# Altium project CPU_PCB.PrjPCB
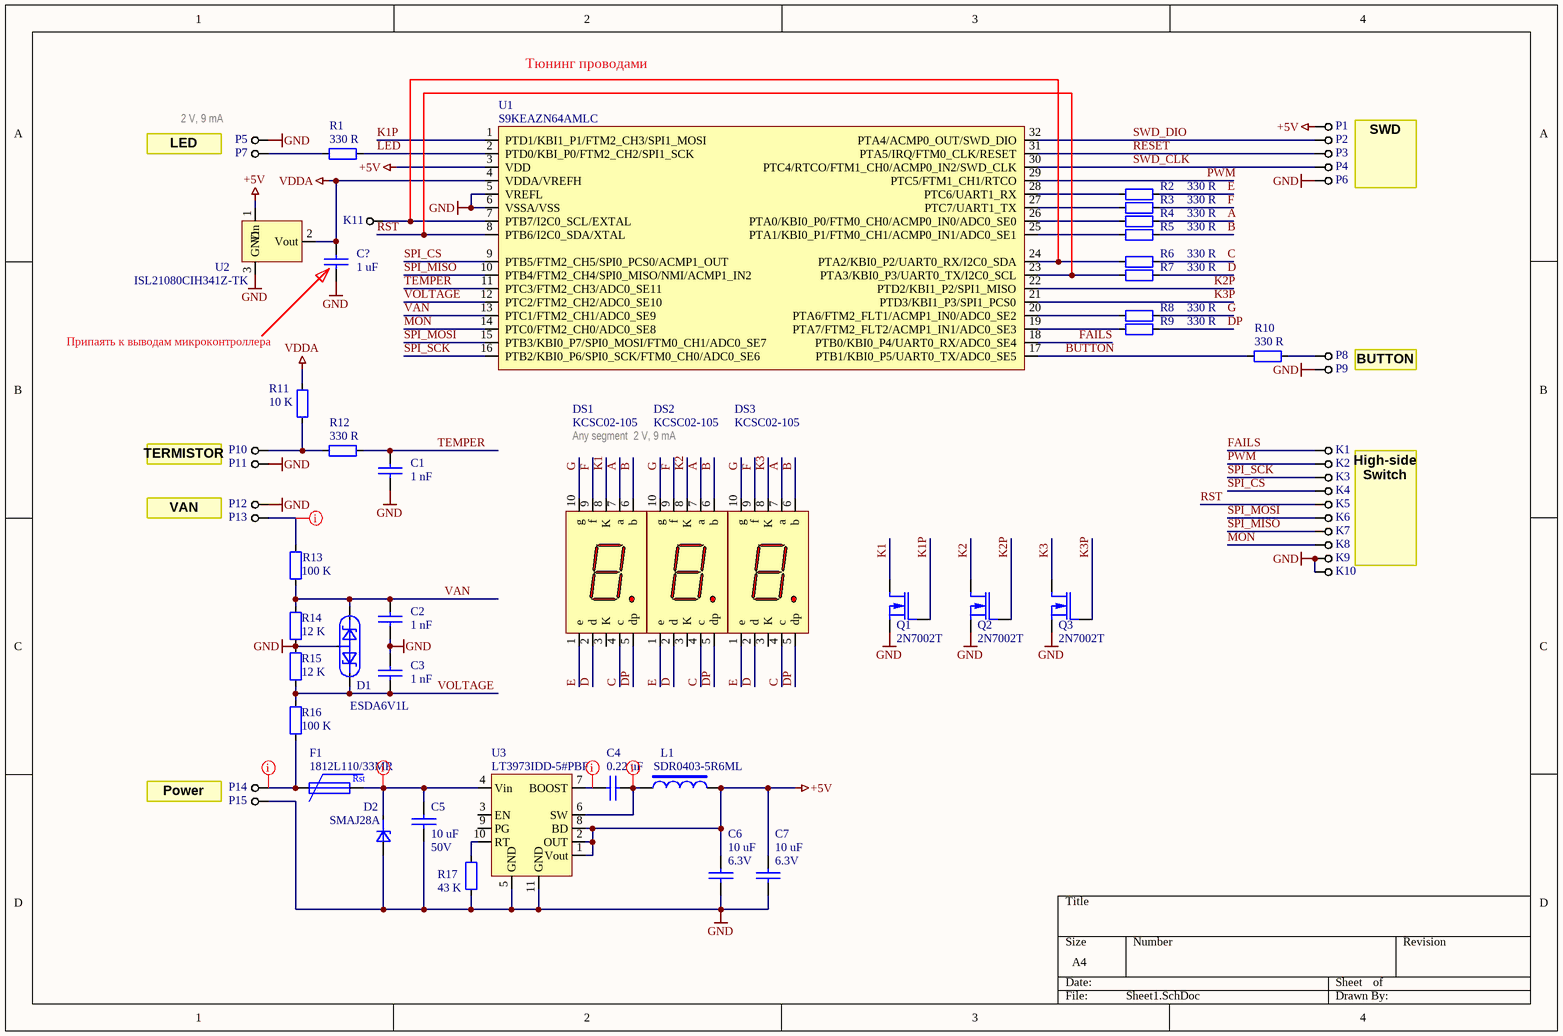
[diagram p0: Sheet1.SchDoc]
1 sheet, 64 parts. Net scope: global (net labels, ports and power ports of the same name join across sheets).
Board file: CPU_PCB.PcbDoc

## Sheet Sheet1.SchDoc
size A4

### Parts
C1  value 1 nF  [1608[0603]]  (hidden comment: CL10B102KB8NNNC)
C2  value 1 nF  [1608[0603]]  (hidden comment: CL10B102KB8NNNC)
C3  value 1 nF  [1608[0603]]  (hidden comment: CL10B102KB8NNNC)
C4  value 0.22 uF  [2012[0805]]  (hidden comment: C0805C224K5RACTU)
C5  value 10 uF  Voltage: 50V  [3225[1210]]  (hidden comment: GRM32DF51H106ZA01L)
C6  value 10 uF  Voltage: 6.3V  [0805-1206]  (hidden comment: GRM21BR60J106KE19L)
C7  value 10 uF  Voltage: 6.3V  [0805-1206]  (hidden comment: GRM21BR60J106KE19L)
C?  value 1 uF  [1608[0603]]  (hidden comment: CL10B102KB8NNNC)
D1  ESDA6V1L  [SOT23]
D2  SMAJ28A  [SMA]
DS1  KCSC02-105  [KCSC02-105]
DS2  KCSC02-105  [KCSC02-105]
DS3  KCSC02-105  [KCSC02-105]
F1  1812L110/33MR  [CR4532-1812/Y1.6]
K1  Pin 0.7 mm  [Mount hole 0.7 mm]  (value not drawn)  (net tie, no BOM)
K2  Pin 0.7 mm  [Mount hole 0.7 mm]  (value not drawn)  (net tie, no BOM)
K3  Pin 0.7 mm  [Mount hole 0.7 mm]  (value not drawn)  (net tie, no BOM)
K4  Pin 0.7 mm  [Mount hole 0.7 mm]  (value not drawn)  (net tie, no BOM)
K5  Pin 0.7 mm  [Mount hole 0.7 mm]  (value not drawn)  (net tie, no BOM)
K6  Pin 0.7 mm  [Mount hole 0.7 mm]  (value not drawn)  (net tie, no BOM)
K7  Pin 0.7 mm  [Mount hole 0.7 mm]  (value not drawn)  (net tie, no BOM)
K8  Pin 0.7 mm  [Mount hole 0.7 mm]  (value not drawn)  (net tie, no BOM)
K9  Pin 0.7 mm  [Mount hole 0.7 mm]  (value not drawn)  (net tie, no BOM)
K10  Pin 0.7 mm  [Mount hole 0.7 mm]  (value not drawn)  (net tie, no BOM)
K11  Pin 0.7 mm  [Mount hole 0.7 mm]  (value not drawn)  (net tie, no BOM)
L1  SDR0403-5R6ML  [SDR0403]
P1  Pin 0.7 mm  [Mount hole 0.7 mm]  (value not drawn)  (net tie, no BOM)
P2  Pin 0.7 mm  [Mount hole 0.7 mm]  (value not drawn)  (net tie, no BOM)
P3  Pin 0.7 mm  [Mount hole 0.7 mm]  (value not drawn)  (net tie, no BOM)
P4  Pin 0.7 mm  [Mount hole 0.7 mm]  (value not drawn)  (net tie, no BOM)
P5  Pin 0.7 mm  [Mount hole 0.7 mm]  (value not drawn)  (net tie, no BOM)
P6  Pin 0.7 mm  [Mount hole 0.7 mm]  (value not drawn)  (net tie, no BOM)
P7  Pin 0.7 mm  [Mount hole 0.7 mm]  (value not drawn)  (net tie, no BOM)
P8  Pin 0.7 mm  [Mount hole 0.7 mm]  (value not drawn)  (net tie, no BOM)
P9  Pin 0.7 mm  [Mount hole 0.7 mm]  (value not drawn)  (net tie, no BOM)
P10  Pin 0.7 mm  [Mount hole 0.7 mm]  (value not drawn)  (net tie, no BOM)
P11  Pin 0.7 mm  [Mount hole 0.7 mm]  (value not drawn)  (net tie, no BOM)
P12  Pin 0.7 mm  [Mount hole 0.7 mm]  (value not drawn)  (net tie, no BOM)
P13  Pin 0.7 mm  [Mount hole 0.7 mm]  (value not drawn)  (net tie, no BOM)
P14  Pin 0.7 mm  [Mount hole 0.7 mm]  (value not drawn)  (net tie, no BOM)
P15  Pin 0.7 mm  [Mount hole 0.7 mm]  (value not drawn)  (net tie, no BOM)
Q1  2N7002T  [SOT-523F]
Q2  2N7002T  [SOT-523F]
Q3  2N7002T  [SOT-523F]
R1  value 330 R  [0603]  (hidden comment: RC0603FR-07330RL)
R2  value 330 R  [0603]  (hidden comment: RC0603FR-07330RL)
R3  value 330 R  [0603]  (hidden comment: RC0603FR-07330RL)
R4  value 330 R  [0603]  (hidden comment: RC0603FR-07330RL)
R5  value 330 R  [0603]  (hidden comment: RC0603FR-07330RL)
R6  value 330 R  [0603]  (hidden comment: RC0603FR-07330RL)
R7  value 330 R  [0603]  (hidden comment: RC0603FR-07330RL)
R8  value 330 R  [0603]  (hidden comment: RC0603FR-07330RL)
R9  value 330 R  [0603]  (hidden comment: RC0603FR-07330RL)
R10  value 330 R  [0603]  (hidden comment: RC0603FR-07330RL)
R11  value 10 K  [0603]  (hidden comment: ERJ-3EKF1002V)
R12  value 330 R  [0603]  (hidden comment: RC0603FR-07330RL)
R13  value 100 K  [0603]  (hidden comment: RC0603FR-10100KL)
R14  value 12 K  [0603]  (hidden comment: RL0603K012-1)
R15  value 12 K  [0603]  (hidden comment: RL0603K012-1)
R16  value 100 K  [0603]  (hidden comment: RC0603FR-10100KL)
R17  value 43 K  [0603]  (hidden comment: RL0603K043-1)
U1  S9KEAZN64AMLC  [LQFP-32 Freescale]
U2  ISL21080CIH341Z-TK  [SOT23]
U3  LT3973IDD-5#PBF  [10-DFN Linear]

### Nets
+5V: C6.2 C7.2 L1.2 P1.1 U1.3(VDD) U2.1(Vin) U3.1(Vout) U3.2(OUT) U3.8(BD)
GND: C1.2 C2.2 C3.1 C5.2 C6.1 C7.1 C?.2 D1.3 D2.2(A) K9.1 K10.1 P5.1 P6.1 P9.1 P11.1 P12.1 P15.1 Q1.2(S) Q2.2(S) Q3.2(S) R14.1 R15.2 R17.1 U1.5(VREFL) U1.6(VSSA/VSS) U2.3(GND) U3.5(GND) U3.11(GND)
VDDA: C?.1 R11.2 U1.4(VDDA/VREFH) U2.2(Vout)
A: DS1.7(a) DS2.7(a) DS3.7(a) R4.2
B: DS1.6(b) DS2.6(b) DS3.6(b) R5.2
BUTTON: R10.1 U1.17(PTB1/KBI0_P5/UART0_TX/ADC0_SE5)
C: DS1.4(c) DS2.4(c) DS3.4(c) R6.2
D: DS1.2(d) DS2.2(d) DS3.2(d) R7.2
DP: DS1.5(dp) DS2.5(dp) DS3.5(dp) R9.2
E: DS1.1(e) DS2.1(e) DS3.1(e) R2.2
F: DS1.9(f) DS2.9(f) DS3.9(f) R3.2
FAILS: K1.1 U1.18(PTB0/KBI0_P4/UART0_RX/ADC0_SE4)
G: DS1.10(g) DS2.10(g) DS3.10(g) R8.2
K1: DS1.8(K) Q1.3(D)
K1P: Q1.1(G) U1.1(PTD1/KBI1_P1/FTM2_CH3/SPI1_MOSI)
K2: DS2.8(K) Q2.3(D)
K2P: Q2.1(G) U1.22(PTD2/KBI1_P2/SPI1_MISO)
K3: DS3.8(K) Q3.3(D)
K3P: Q3.1(G) U1.21(PTD3/KBI1_P3/SPI1_PCS0)
LED: R1.2 U1.2(PTD0/KBI_P0/FTM2_CH2/SPI1_SCK)
MON: K8.1 U1.14(PTC0/FTM2_CH0/ADC0_SE8)
PWM: K2.1 U1.29(PTC5/FTM1_CH1/RTCO)
RESET: P3.1 U1.31(PTA5/IRQ/FTM0_CLK/RESET)
RST: K5.1 R7.1 U1.8(PTB6/I2C0_SDA/XTAL) U1.23(PTA3/KBI0_P3/UART0_TX/I2C0_SCL)
SPI_CS: K4.1 U1.9(PTB5/FTM2_CH5/SPI0_PCS0/ACMP1_OUT)
SPI_MISO: K7.1 U1.10(PTB4/FTM2_CH4/SPI0_MISO/NMI/ACMP1_IN2)
SPI_MOSI: K6.1 U1.15(PTB3/KBI0_P7/SPI0_MOSI/FTM0_CH1/ADC0_SE7)
SPI_SCK: K3.1 U1.16(PTB2/KBI0_P6/SPI0_SCK/FTM0_CH0/ADC0_SE6)
SWD_CLK: P4.1 U1.30(PTC4/RTCO/FTM1_CH0/ACMP0_IN2/SWD_CLK)
SWD_DIO: P2.1 U1.32(PTA4/ACMP0_OUT/SWD_DIO)
TEMPER: C1.1 R12.2 U1.11(PTC3/FTM2_CH3/ADC0_SE11)
VAN: C2.1 D1.1 R13.1 R14.2 U1.13(PTC1/FTM2_CH1/ADC0_SE9)
VOLTAGE: C3.2 D1.2 R15.1 R16.2 U1.12(PTC2/FTM2_CH2/ADC0_SE10)
NetC4_1: C4.1 U3.7(BOOST)
NetC4_2: C4.2 L1.1 U3.6(SW)
NetC5_1: C5.1 D2.1(K) F1.2 U3.4(Vin)
NetF1_1: F1.1 P14.1 R16.1
NetK11_1: K11.1 R6.1 U1.7(PTB7/I2C0_SCL/EXTAL) U1.24(PTA2/KBI0_P2/UART0_RX/I2C0_SDA)
NetP7_1: P7.1 R1.1
NetP8_1: P8.1 R10.2
NetP10_1: P10.1 R11.1 R12.1
NetP13_1: P13.1 R13.2
NetR2_1: R2.1 U1.28(PTC6/UART1_RX)
NetR3_1: R3.1 U1.27(PTC7/UART1_TX)
NetR4_1: R4.1 U1.26(PTA0/KBI0_P0/FTM0_CH0/ACMP0_IN0/ADC0_SE0)
NetR5_1: R5.1 U1.25(PTA1/KBI0_P1/FTM0_CH1/ACMP0_IN1/ADC0_SE1)
NetR8_1: R8.1 U1.20(PTA6/FTM2_FLT1/ACMP1_IN0/ADC0_SE2)
NetR9_1: R9.1 U1.19(PTA7/FTM2_FLT2/ACMP1_IN1/ADC0_SE3)
NetR17_2: R17.2 U3.10(RT)

Not connected (* = marked no-connect by the designer): DS1 3(K); DS2 3(K); DS3 3(K); U3 3(EN) 9(PG)

### Layout directives
net class 24V: NetC4_1, NetC4_2, NetC5_1, NetF1_1, NetP13_1

### Notes on the sheet
- Тюнинг проводами
- LED
- 2 V, 9 mA
- SWD
- Припаять к выводам микроконтроллера
- BUTTON
- Any segment  2 V, 9 mA
- VAN
- TERMISTOR
- High-side Switch
- Power
- (in symbol 1812L110/33MR) Rst

### Library data of the parts
C1-C3 C? = CVNF1.0K0603: 1 nF, 50V, 10%, X7R, 0603 SMD MLC Capacitor; Manufacturer: SAMSUNG; Tolerance: +-10%; Distributor: Future; Price: 0.0047 Euro; PartNum: CL10B102KB8NNNC; Voltage: 50 V; PartName: CL10B102KB8NNNC
C4 = C0805C224K5RACTU: 0.22 uF, 50V, X7R,  0805; Manufacturer: Kemet; PartNum: 399-3491-1-ND; Tolerance: +-10%; Distributor: Digi-Key; Price: 0.1$; Voltage: 50 V
C5 = GRM32DF51H106ZA01L: 10uF, 50V, 20%, Y5V (F), 1210; Manufacturer: Murata Electronics North America; PartNum: 490-1891-1-ND; Boards Count: 1; Tolerance: 20%; Price: 0.95$; Distributor: DigiKey; PartName: GRM32DF51H106ZA01L
C6 C7 = GRM21BR60J106KE19L: 10 uF, 6.3V, X5R, 10%, 0805; Manufacturer: Murata; PartNum: 490-1717-1-ND; Distributor: Digi-Key; Price: 0.4$; Tolerance: 10%; PartName: GRM21BR60J106KE19L
D1 = ESDA6V1L: Dual transil array for ESD, 6.1 V, 300 W; Manufacturer: Micro Commercial Co; PartNum: ESDA6V1L-TPCT-ND; PartName: ESDA6V1L-TP; Distributor: Digi-Key; Price: 0.23$
D2 = SMAJ28A: DIODE TVS 28V 400W UNI 5% SMD; Manufacturer: Bourns Inc.; PartNum: SMAJ28ABCT-ND; Distributor: Digi-Key; Price: 0.18$; PartName: SMAJ28A; Value: 28 V
F1 = 1812L110/33MR: PTC RESETTABLE 33V, 1.10A, 1812L; Manufacturer: Littelfuse Inc; PartNum: F3486CT-ND; Distributor: Digi-Key; Price: 0.57$; PartName: 1812L110/33MR
L1 = SDR0403-5R6ML: SMD Power Inductor 5.6 uH, 100 mOhm, 1.6 A; Manufacturer: BOURNS; PartNum: 2328718; Tolerance: 20%; Value: 5.6 uH; Distributor: Farnell; Price: 0.36 Euro; PartName: SDR0403-5R6ML
Q1-Q3 = 2N7002T: MOSFET N-CH, 60V, 115 mA, SOT-523F-3; Manufacturer: FAIRCHILD SEMICONDUCTOR; PartNum: 2322570; Distributor: Farnell; Price: 0.11 Euro; PartName: 2N7002T
R1-R10 R12 = RL0603E330-1_1: 330 R, 1%, 0603, SMD Resistor, Taped; Manufacturer: YAGEO AMERICA CORPORATION; Voltage: 75 V; Distributor: Future; Price: 0.0017$; Tolerance: 1%; PartNum: RC0603FR-07330RL; PartName: RC0603FR-07330RL; Price50: 0.0017$; Price100: 0.0017$; Price1000: 0.0017$
R11 = RL0603K010-1_1: 10 K, 1%, 0603, SMD Resistor, Taped; Manufacturer: PANASONIC; Voltage: 75 V; Distributor: Future; Price: 0.0015 Euro; Tolerance: 1%; PartNum: ERJ-3EKF1002V; PartName: ERJ-3EKF1002V; Price50: 0.0015 Euro; Price100: 0.0015 Euro; Price1000: 0.0015 Euro
R13 R16 = RL0603K100-1_1: 100 K, 1%, 0603, SMD Resistor, Taped; Manufacturer: YAGEO AMERICA CORPORATION; Voltage: 75 V; Distributor: Future; Price: 0.0017$; Tolerance: 1%; PartNum: RC0603FR-10100KL; PartName: RC0603FR-10100KL; Price50: 0.0017$; Price100: 0.0017$; Price1000: 0.0017$
R14 R15 = RL0603K012-1: 12 K, 1%, 0603, SMD Resistor, Taped; Manufacturer: Vishay; Voltage: 75 V; Distributor: Schukat; Price: 0.002 Euro; Tolerance: 1%; PartNum: RL0603K012-1; PartName: RL0603K012-1
R17 = RL0603K043-1: 43 K, 1%, 0603, SMD Resistor, Taped; Manufacturer: Vishay; Voltage: 75 V; Distributor: Schukat; Price: 0.002 Euro; Tolerance: 1%; PartNum: RL0603K043-1
U1 = S9KEAZN64AMLC: Manufacturer: Freescale; PartName: S9KEAZN64AMLC
U2 = ISL21080CIH341Z-TK: Voltage References 4.096 V, Iout 7 mA, 4.5<Vin<8, Iq < 0.3uA, -40..+85 C, SOT23; Manufacturer: Intersil; PartNum: 2358146; Price: 0.84 Euro; Distributor: Farnel; PartName: ISL21080CIH341Z-TK
U3 = LT3973IDD-5#PBF: BUCK 2.2 MHz,  In 42V, Out 5V, 0.75A, -40..125C, 10-DFN; Manufacturer: Linear; PartNum: 2115834; Price: 4.873 Euro; Distributor: Farnell; PartName: LT3973IDD-5#PBF
DS1-DS3 = KCSC02-105: PartName: KCSC02-105
K1-K11 P1-P15 = Pin 0.7 mm: PartName: Pin 0.7 mm